# Altium schematic sheet DAC Offset.SchDoc
size 297 x 209 mm; CompanyName: Sainsbury Wellcome Centre; Organization: FabLab; Address1: Sainsbury Wellcome Centre; Address2: 25 Howland Street; Address3: London; Address4: W1T 4JG; DocumentNumber: 10; SheetNumber: 10; SheetTotal: 12; swcgroup: FabLab; Org: Sainsbury Wellcome Centre; Add1: 25 Howland Street; Add2: London; Add3: W1T 4JG; WebAddress: www.sainsburywellcome.org; SheetSize: A4; SheetName: Level Shifter
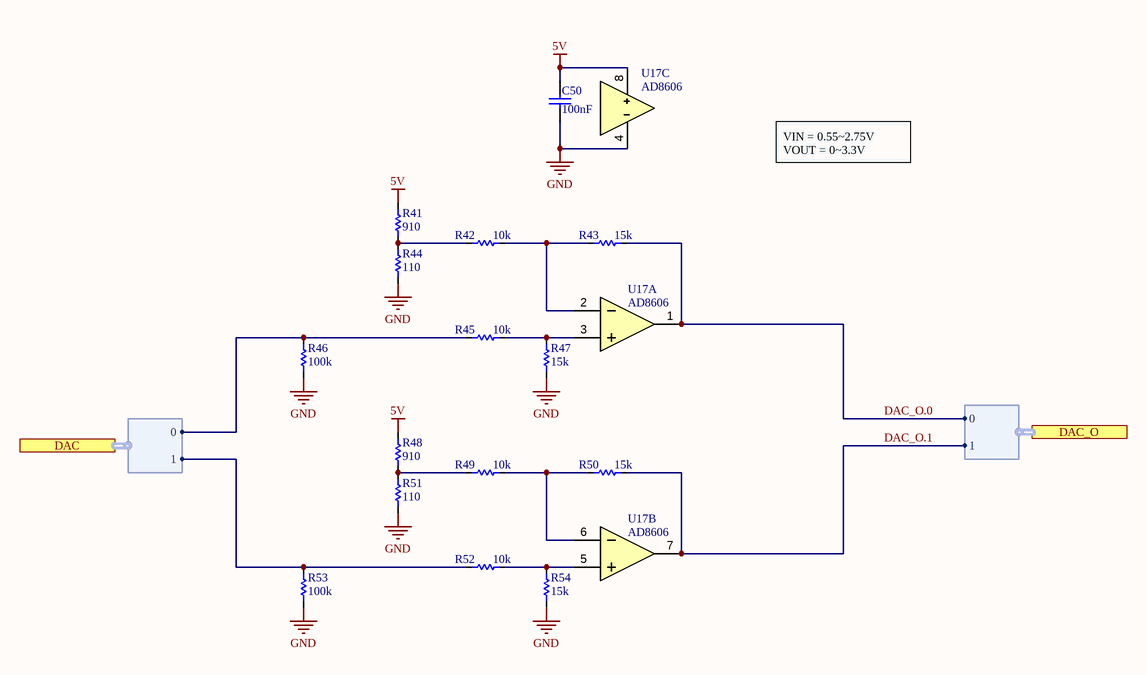
[diagram p0: DAC Offset.SchDoc]

## Parts
C50  value 100nF  [CAP_CHIP_0603]  (hidden comment: C0603-100nF-50V)
R41  value 910  [RES_CHIP_0603]  (hidden comment: R0603-910R)
R42  value 10k  [RES_CHIP_0603]  (hidden comment: R0603-10K)
R43  value 15k  [RES_CHIP_0603]  (hidden comment: R0603-15K)
R44  value 110  [RES_CHIP_0603]  (hidden comment: R0603-110R)
R45  value 10k  [RES_CHIP_0603]  (hidden comment: R0603-10K)
R46  value 100k  [RES_CHIP_0603]  (hidden comment: R0603-100K)
R47  value 15k  [RES_CHIP_0603]  (hidden comment: R0603-15K)
R48  value 910  [RES_CHIP_0603]  (hidden comment: R0603-910R)
R49  value 10k  [RES_CHIP_0603]  (hidden comment: R0603-10K)
R50  value 15k  [RES_CHIP_0603]  (hidden comment: R0603-15K)
R51  value 110  [RES_CHIP_0603]  (hidden comment: R0603-110R)
R52  value 10k  [RES_CHIP_0603]  (hidden comment: R0603-10K)
R53  value 100k  [RES_CHIP_0603]  (hidden comment: R0603-100K)
R54  value 15k  [RES_CHIP_0603]  (hidden comment: R0603-15K)
U17  AD8606  [VSSOP8_3X3_0.65E]  (parts A,B,C of 3)

## Ports
DAC (harness DAC), DAC_O (harness DAC_O)

## Harnesses
DAC: 1, 0
DAC_O: 1, 0

## Nets
5V: C50.2 R41.2 R48.2 U17.8(V+)
GND: C50.1 R44.1 R46.1 R47.1 R51.1 R53.1 R54.1 U17.4(V-)
DAC_O.0: R43.2 U17.1(AOUT) ; port DAC_O.0
DAC_O.1: R50.2 U17.7(BOUT) ; port DAC_O.1
NetR41_1: R41.1 R42.1 R44.2
NetR42_2: R42.2 R43.1 U17.2(A-)
NetR45_1: R45.1 R46.2 ; port DAC.0
NetR45_2: R45.2 R47.2 U17.3(A+)
NetR48_1: R48.1 R49.1 R51.2
NetR49_2: R49.2 R50.1 U17.6(B-)
NetR52_1: R52.1 R53.2 ; port DAC.1
NetR52_2: R52.2 R54.2 U17.5(B+)

## Notes on the sheet
- VIN = 0.55~2.75V
  VOUT = 0~3.3V
- FILE
- VARIANT
- DATE
- REVISION
- SHEET
- /
- PROJECT
- SIZE

## Library data of the parts
C50 = CMP-611-0027-24: 0603 Multilayer Ceramic Capacitors MLCC; PartNumber: CC0603KRX7R9BB104; Tolerance: 10%; Pick&PlaceFootprint: C0603; Dielectric: X7R; Voltage Rating: 50V; Capacitor Type: Ceramic; RoHS: Yes; Mount: SMD; LCSC Part N.: C14663; Case/Package: 0603
R41 R48 = CMP-633-0088-12: 100mW Thick Film Resistors 75V ±100ppm/℃ ±1% 0603 Chip Resistor; PartNumber: HPCR0603F910RK9; Number of Resistors: 1; Pick&PlaceFootprint: R0603; LCSC Part N.: C365225; Case/Package: 0603; Tolerance: 1%; Mount: Surface Mount; Power Rating: 100mW; Voltage Rating: 75V
R42 R45 R49 R52 = CMP-633-0002-26: 100mW Thick Film Resistors 75V ±100ppm/℃ ±1% 0603 Chip Resistor; PartNumber: 0603WAF1002T5E; Number of Resistors: 1; Pick&PlaceFootprint: R0603; Case/Package: 0603; Voltage Rating: 75V; Power Rating: 100mW; LCSC Part N.: C25804; Tolerance: 1%; Mount: Surface Mount
R43 R47 R50 R54 = CMP-633-0136-2: 100mW Thick Film Resistors 75V ±100ppm/℃ ±1% 0603 Chip Resistor; PartNumber: 0603WAF1502T5E; Pick&PlaceFootprint: R0603; Number of Resistors: 1; Power Rating: 100mW; Mount: Surface Mount; Voltage Rating: 75V; LCSC Part N.: C22809; Tolerance: 1%; Case/Package: 0603
R44 R51 = CMP-633-0080-13: 100mW Thick Film Resistors 75V ±100ppm/℃ ±1% 0603 Chip Resistor; PartNumber: RT0603BRD07110RL; Pick&PlaceFootprint: R0603; Number of Resistors: 1; Case/Package: 0603; Tolerance: 1%; Mount: Surface Mount; LCSC Part N.: C705717; Voltage Rating: 75V; Power Rating: 100mW
R46 R53 = CMP-633-0000-28: 100mW Thick Film Resistors 75V ±100ppm/℃ ±1% 0603 Chip Resistor; PartNumber: 0603WAF1003T5E; Number of Resistors: 1; Pick&PlaceFootprint: R0603; LCSC Part N.: C25803; Mount: Surface Mount; Voltage Rating: 75V; Power Rating: 100mW; Case/Package: 0603; Tolerance: 1%
U17 = CMP-941-0002-4: Operational Amplifier, 2 Func, 750uV Offset-Max, CMOS, PDSO8; PartNumber: AD8606ARMZ-REEL; Pick&PlaceFootprint: MSOP-8; Slew Rate: 5V/µs; Min Supply Voltage: 0V; Input Offset Voltage: 65µV; CMRR: 100dB; Max Supply Voltage: 5V; Voltage Drift: 4.5µV/°C; PSRR: 95dB; Quiescent Current: 1mA; Max Supply Current: 80mA; Gain Bandwidth: 10MHz; LCSC Part N.: C459905